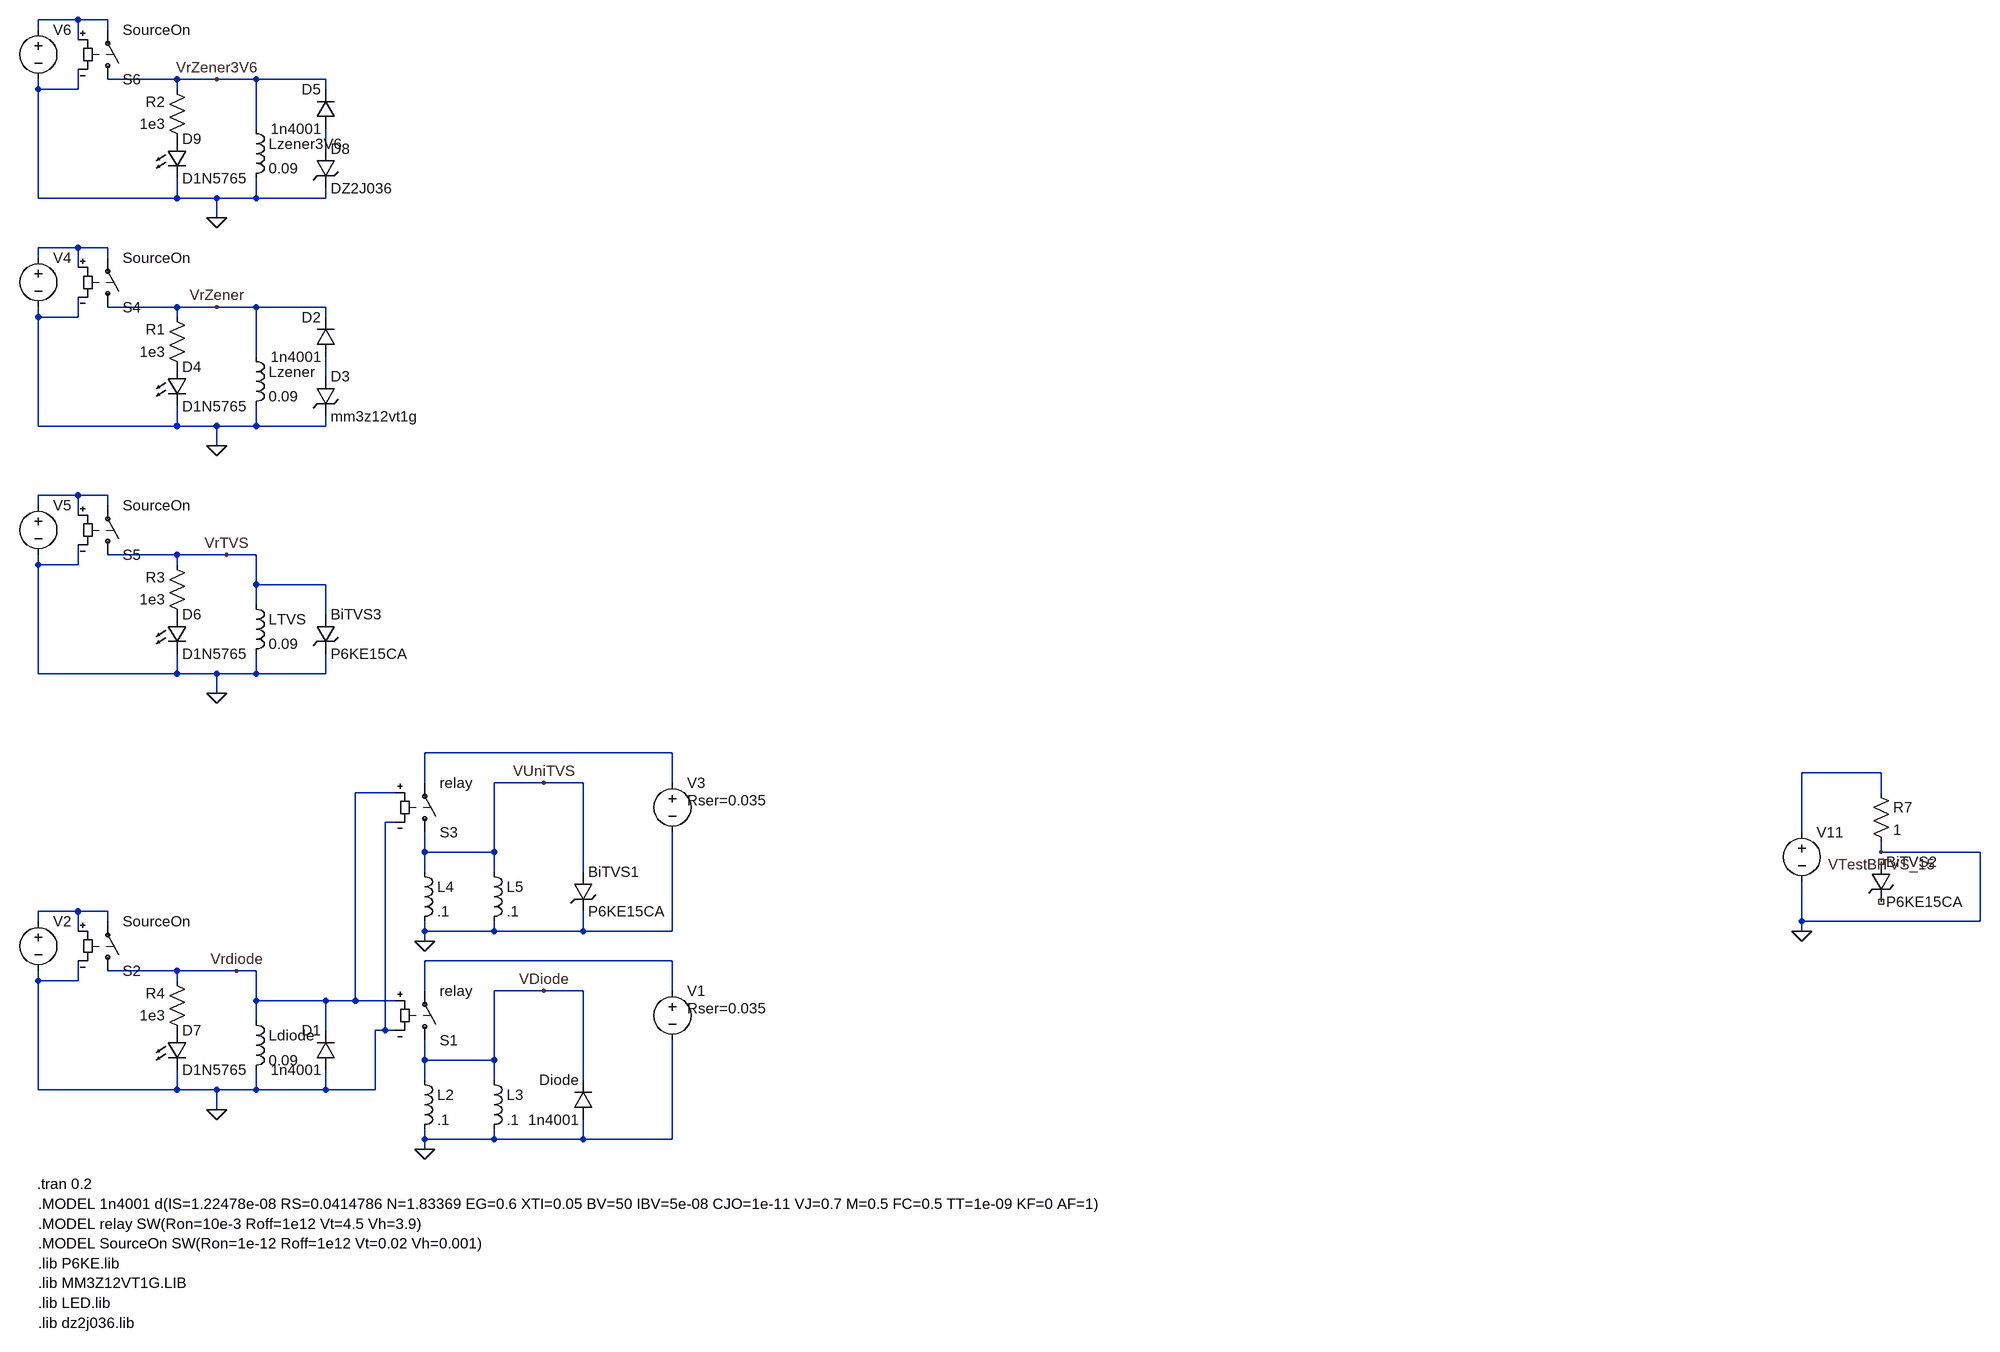
[diagram p0: schematic TVSTest.asc]
TVSTest.asc, the LTspice schematic file:
Version 4
SHEET 1 2628 680
WIRE -880 -1488 -944 -1488
WIRE -832 -1488 -880 -1488
WIRE -944 -1472 -944 -1488
WIRE -832 -1472 -832 -1488
WIRE -880 -1456 -880 -1488
WIRE -720 -1392 -832 -1392
WIRE -656 -1392 -720 -1392
WIRE -592 -1392 -656 -1392
WIRE -480 -1392 -592 -1392
WIRE -944 -1376 -944 -1392
WIRE -880 -1376 -880 -1408
WIRE -880 -1376 -944 -1376
WIRE -720 -1376 -720 -1392
WIRE -480 -1376 -480 -1392
WIRE -592 -1312 -592 -1392
WIRE -480 -1280 -480 -1312
WIRE -944 -1200 -944 -1376
WIRE -720 -1200 -720 -1232
WIRE -720 -1200 -944 -1200
WIRE -656 -1200 -720 -1200
WIRE -592 -1200 -592 -1232
WIRE -592 -1200 -656 -1200
WIRE -480 -1200 -480 -1216
WIRE -480 -1200 -592 -1200
WIRE -656 -1168 -656 -1200
WIRE -880 -1120 -944 -1120
WIRE -832 -1120 -880 -1120
WIRE -944 -1104 -944 -1120
WIRE -832 -1104 -832 -1120
WIRE -880 -1088 -880 -1120
WIRE -720 -1024 -832 -1024
WIRE -656 -1024 -720 -1024
WIRE -592 -1024 -656 -1024
WIRE -480 -1024 -592 -1024
WIRE -944 -1008 -944 -1024
WIRE -880 -1008 -880 -1040
WIRE -880 -1008 -944 -1008
WIRE -720 -1008 -720 -1024
WIRE -480 -1008 -480 -1024
WIRE -592 -944 -592 -1024
WIRE -480 -912 -480 -944
WIRE -944 -832 -944 -1008
WIRE -720 -832 -720 -864
WIRE -720 -832 -944 -832
WIRE -656 -832 -720 -832
WIRE -592 -832 -592 -864
WIRE -592 -832 -656 -832
WIRE -480 -832 -480 -848
WIRE -480 -832 -592 -832
WIRE -656 -800 -656 -832
WIRE -880 -720 -944 -720
WIRE -832 -720 -880 -720
WIRE -944 -704 -944 -720
WIRE -832 -704 -832 -720
WIRE -880 -688 -880 -720
WIRE -720 -624 -832 -624
WIRE -640 -624 -720 -624
WIRE -592 -624 -640 -624
WIRE -944 -608 -944 -624
WIRE -880 -608 -880 -640
WIRE -880 -608 -944 -608
WIRE -720 -608 -720 -624
WIRE -592 -576 -592 -624
WIRE -480 -576 -592 -576
WIRE -592 -544 -592 -576
WIRE -480 -528 -480 -576
WIRE -944 -432 -944 -608
WIRE -720 -432 -720 -464
WIRE -720 -432 -944 -432
WIRE -656 -432 -720 -432
WIRE -592 -432 -592 -464
WIRE -592 -432 -656 -432
WIRE -480 -432 -480 -464
WIRE -480 -432 -592 -432
WIRE -656 -400 -656 -432
WIRE 80 -304 -320 -304
WIRE 2032 -272 1904 -272
WIRE -320 -256 -320 -304
WIRE -128 -256 -208 -256
WIRE -64 -256 -128 -256
WIRE 80 -256 80 -304
WIRE -368 -240 -432 -240
WIRE 2032 -240 2032 -272
WIRE -368 -192 -384 -192
WIRE 1904 -176 1904 -272
WIRE -320 -144 -320 -176
WIRE -208 -144 -208 -256
WIRE -208 -144 -320 -144
WIRE 2032 -144 2032 -160
WIRE 2192 -144 2032 -144
WIRE -320 -112 -320 -144
WIRE -208 -112 -208 -144
WIRE -64 -112 -64 -256
WIRE -880 -48 -944 -48
WIRE -832 -48 -880 -48
WIRE -944 -32 -944 -48
WIRE -832 -32 -832 -48
WIRE 1904 -32 1904 -96
WIRE 2192 -32 2192 -144
WIRE 2192 -32 1904 -32
WIRE -880 -16 -880 -48
WIRE -320 -16 -320 -32
WIRE -208 -16 -208 -32
WIRE -208 -16 -320 -16
WIRE -64 -16 -64 -48
WIRE -64 -16 -208 -16
WIRE 80 -16 80 -176
WIRE 80 -16 -64 -16
WIRE 1904 -16 1904 -32
WIRE -320 0 -320 -16
WIRE 80 32 -320 32
WIRE -720 48 -832 48
WIRE -624 48 -720 48
WIRE -592 48 -624 48
WIRE -944 64 -944 48
WIRE -880 64 -880 32
WIRE -880 64 -944 64
WIRE -720 64 -720 48
WIRE -320 80 -320 32
WIRE -128 80 -208 80
WIRE -64 80 -128 80
WIRE 80 80 80 32
WIRE -592 96 -592 48
WIRE -480 96 -592 96
WIRE -432 96 -432 -240
WIRE -432 96 -480 96
WIRE -368 96 -432 96
WIRE -592 128 -592 96
WIRE -480 144 -480 96
WIRE -384 144 -384 -192
WIRE -384 144 -400 144
WIRE -368 144 -384 144
WIRE -320 192 -320 160
WIRE -208 192 -208 80
WIRE -208 192 -320 192
WIRE -320 224 -320 192
WIRE -208 224 -208 192
WIRE -64 224 -64 80
WIRE -944 240 -944 64
WIRE -720 240 -720 208
WIRE -720 240 -944 240
WIRE -656 240 -720 240
WIRE -592 240 -592 208
WIRE -592 240 -656 240
WIRE -480 240 -480 208
WIRE -480 240 -592 240
WIRE -400 240 -400 144
WIRE -400 240 -480 240
WIRE -656 272 -656 240
WIRE -320 320 -320 304
WIRE -208 320 -208 304
WIRE -208 320 -320 320
WIRE -64 320 -64 288
WIRE -64 320 -208 320
WIRE 80 320 80 160
WIRE 80 320 -64 320
WIRE -320 336 -320 320
FLAG -320 336 0
FLAG -656 272 0
FLAG -320 0 0
FLAG -128 80 VDiode
FLAG -128 -256 VUniTVS
FLAG 1904 -16 0
FLAG 2032 -144 VTestBiTVS_15
FLAG -656 -400 0
FLAG -656 -800 0
FLAG -624 48 Vrdiode
FLAG -640 -624 VrTVS
FLAG -656 -1024 VrZener
FLAG -656 -1168 0
FLAG -656 -1392 VrZener3V6
SYMBOL ind -608 112 R0
SYMATTR InstName Ldiode
SYMATTR Value 0.09
SYMATTR SpiceLine Rser=320
SYMBOL diode -464 208 R180
WINDOW 0 24 64 Left 2
WINDOW 3 24 0 Left 2
SYMATTR InstName D1
SYMATTR Value 1n4001
SYMBOL sw -320 176 M180
SYMATTR InstName S1
SYMATTR Value relay
SYMBOL ind -336 208 R0
SYMATTR InstName L2
SYMATTR Value .1
SYMATTR SpiceLine Rser=12
SYMBOL ind -224 208 R0
SYMATTR InstName L3
SYMATTR Value .1
SYMATTR SpiceLine Rser=12
SYMBOL diode -48 288 R180
WINDOW 0 24 64 Left 2
WINDOW 3 24 0 Left 2
SYMATTR InstName Diode
SYMATTR Value 1n4001
SYMBOL voltage -944 -48 R0
WINDOW 3 24 96 Invisible 2
WINDOW 123 0 0 Left 2
WINDOW 39 0 0 Left 2
SYMATTR InstName V2
SYMATTR Value PWL(0 0 0.000001 12.6 0.1 12.6 0.100001 0)
SYMBOL voltage 80 64 R0
WINDOW 3 24 96 Invisible 2
WINDOW 123 0 0 Left 2
WINDOW 39 24 44 Left 2
SYMATTR InstName V1
SYMATTR Value 12.6
SYMATTR SpiceLine Rser=0.035
SYMBOL sw -832 64 M180
SYMATTR InstName S2
SYMATTR Value SourceOn
SYMBOL sw -320 -160 M180
SYMATTR InstName S3
SYMATTR Value relay
SYMBOL ind -336 -128 R0
SYMATTR InstName L4
SYMATTR Value .1
SYMATTR SpiceLine Rser=12
SYMBOL ind -224 -128 R0
SYMATTR InstName L5
SYMATTR Value .1
SYMATTR SpiceLine Rser=12
SYMBOL voltage 80 -272 R0
WINDOW 3 24 96 Invisible 2
WINDOW 123 0 0 Left 2
WINDOW 39 24 44 Left 2
SYMATTR InstName V3
SYMATTR Value 12.6
SYMATTR SpiceLine Rser=0.035
SYMBOL voltage 1904 -192 R0
WINDOW 3 24 96 Invisible 2
WINDOW 123 0 0 Left 2
WINDOW 39 0 0 Left 2
SYMATTR InstName V11
SYMATTR Value PWL(0 0 0.2 120)
SYMBOL TVSdiode 2016 -128 R0
SYMATTR InstName BiTVS2
SYMATTR Value P6KE15CA
SYMATTR Prefix x
SYMBOL res 2016 -256 R0
SYMATTR InstName R7
SYMATTR Value 1
SYMBOL TVSdiode -80 -112 R0
SYMATTR InstName BiTVS1
SYMATTR Value P6KE15CA
SYMATTR Prefix x
SYMBOL ind -608 -560 R0
SYMATTR InstName LTVS
SYMATTR Value 0.09
SYMATTR SpiceLine Rser=320
SYMBOL voltage -944 -720 R0
WINDOW 3 24 96 Invisible 2
WINDOW 123 0 0 Left 2
WINDOW 39 0 0 Left 2
SYMATTR InstName V5
SYMATTR Value PWL(0 0 0.000001 12.6 0.1 12.6 0.100001 0)
SYMBOL sw -832 -608 M180
SYMATTR InstName S5
SYMATTR Value SourceOn
SYMBOL TVSdiode -496 -528 R0
SYMATTR InstName BiTVS3
SYMATTR Value P6KE15CA
SYMATTR Prefix x
SYMBOL ind -608 -960 R0
SYMATTR InstName Lzener
SYMATTR Value 0.09
SYMATTR SpiceLine Rser=320
SYMBOL voltage -944 -1120 R0
WINDOW 3 24 96 Invisible 2
WINDOW 123 0 0 Left 2
WINDOW 39 0 0 Left 2
SYMATTR InstName V4
SYMATTR Value PWL(0 0 0.000001 12.6 0.1 12.6 0.100001 0)
SYMBOL sw -832 -1008 M180
SYMATTR InstName S4
SYMATTR Value SourceOn
SYMBOL diode -464 -944 R180
WINDOW 0 24 64 Left 2
WINDOW 3 24 0 Left 2
SYMATTR InstName D2
SYMATTR Value 1n4001
SYMBOL zener -496 -912 R0
SYMATTR InstName D3
SYMATTR Value mm3z12vt1g
SYMATTR Prefix X
SYMBOL LED -736 -928 R0
SYMATTR InstName D4
SYMATTR Value D1N5765
SYMATTR Prefix X
SYMBOL res -704 -912 R180
WINDOW 0 36 76 Left 2
WINDOW 3 36 40 Left 2
SYMATTR InstName R1
SYMATTR Value 1e3
SYMBOL LED -736 -528 R0
SYMATTR InstName D6
SYMATTR Value D1N5765
SYMATTR Prefix X
SYMBOL res -704 -512 R180
WINDOW 0 36 76 Left 2
WINDOW 3 36 40 Left 2
SYMATTR InstName R3
SYMATTR Value 1e3
SYMBOL LED -736 144 R0
SYMATTR InstName D7
SYMATTR Value D1N5765
SYMATTR Prefix X
SYMBOL res -704 160 R180
WINDOW 0 36 76 Left 2
WINDOW 3 36 40 Left 2
SYMATTR InstName R4
SYMATTR Value 1e3
SYMBOL ind -608 -1328 R0
SYMATTR InstName Lzener3V6
SYMATTR Value 0.09
SYMATTR SpiceLine Rser=320
SYMBOL voltage -944 -1488 R0
WINDOW 3 24 96 Invisible 2
WINDOW 123 0 0 Left 2
WINDOW 39 0 0 Left 2
SYMATTR InstName V6
SYMATTR Value PWL(0 0 0.000001 12.6 0.1 12.6 0.100001 0)
SYMBOL sw -832 -1376 M180
SYMATTR InstName S6
SYMATTR Value SourceOn
SYMBOL diode -464 -1312 R180
WINDOW 0 24 64 Left 2
WINDOW 3 24 0 Left 2
SYMATTR InstName D5
SYMATTR Value 1n4001
SYMBOL zener -496 -1280 R0
SYMATTR InstName D8
SYMATTR Value DZ2J036
SYMATTR Prefix X
SYMBOL LED -736 -1296 R0
SYMATTR InstName D9
SYMATTR Value D1N5765
SYMATTR Prefix X
SYMBOL res -704 -1280 R180
WINDOW 0 36 76 Left 2
WINDOW 3 36 40 Left 2
SYMATTR InstName R2
SYMATTR Value 1e3
TEXT -946 392 Left 2 !.tran 0.2
TEXT -944 424 Left 2 !.MODEL 1n4001 d(IS=1.22478e-08 RS=0.0414786 N=1.83369 EG=0.6 XTI=0.05 BV=50 IBV=5e-08 CJO=1e-11 VJ=0.7 M=0.5 FC=0.5 TT=1e-09 KF=0 AF=1)
TEXT -944 456 Left 2 !.MODEL relay SW(Ron=10e-3 Roff=1e12 Vt=4.5 Vh=3.9)
TEXT -944 488 Left 2 !.MODEL SourceOn SW(Ron=1e-12 Roff=1e12 Vt=0.02 Vh=0.001)
TEXT -944 520 Left 2 !.lib P6KE.lib
TEXT -944 552 Left 2 !.lib MM3Z12VT1G.LIB
TEXT -944 584 Left 2 !.lib LED.lib
TEXT -944 616 Left 2 !.lib dz2j036.lib

The netlist it stands for:
* TVSTest.asc
Ldiode Vrdiode 0 0.09 Rser=320
D1 0 Vrdiode 1n4001
S1 VDiode N009 Vrdiode 0 relay
L2 VDiode 0 .1 Rser=12
L3 VDiode 0 .1 Rser=12
Diode 0 VDiode 1n4001
V2 N008 0 PWL(0 0 0.000001 12.6 0.1 12.6 0.100001 0)
V1 N009 0 12.6 Rser=0.035
S2 Vrdiode N008 N008 0 SourceOn
S3 VUniTVS N006 Vrdiode 0 relay
L4 VUniTVS 0 .1 Rser=12
L5 VUniTVS 0 .1 Rser=12
V3 N006 0 12.6 Rser=0.035
V11 N007 0 PWL(0 0 0.2 120)
XBiTVS2 NC_01 NC_02 P6KE15CA  ; pins + -
R7 N007 0 1
XBiTVS1 VUniTVS 0 P6KE15CA  ; pins + -
LTVS VrTVS 0 0.09 Rser=320
V5 N005 0 PWL(0 0 0.000001 12.6 0.1 12.6 0.100001 0)
S5 VrTVS N005 N005 0 SourceOn
XBiTVS3 VrTVS 0 P6KE15CA  ; pins + -
Lzener VrZener 0 0.09 Rser=320
V4 N003 0 PWL(0 0 0.000001 12.6 0.1 12.6 0.100001 0)
S4 VrZener N003 N003 0 SourceOn
D2 N004 VrZener 1n4001
XD3 N004 0 mm3z12vt1g  ; pins + -
XD4 P001 0 D1N5765  ; pins + -
R1 P001 VrZener 1e3
XD6 P002 0 D1N5765  ; pins + -
R3 P002 VrTVS 1e3
XD7 P003 0 D1N5765  ; pins + -
R4 P003 Vrdiode 1e3
Lzener3V6 VrZener3V6 0 0.09 Rser=320
V6 N001 0 PWL(0 0 0.000001 12.6 0.1 12.6 0.100001 0)
S6 VrZener3V6 N001 N001 0 SourceOn
D5 N002 VrZener3V6 1n4001
XD8 N002 0 DZ2J036  ; pins + -
XD9 P004 0 D1N5765  ; pins + -
R2 P004 VrZener3V6 1e3
.model D D
.lib standard.dio
.tran 0.2
.MODEL 1n4001 d(IS=1.22478e-08 RS=0.0414786 N=1.83369 EG=0.6 XTI=0.05 BV=50 IBV=5e-08 CJO=1e-11 VJ=0.7 M=0.5 FC=0.5 TT=1e-09 KF=0 AF=1)
.MODEL relay SW(Ron=10e-3 Roff=1e12 Vt=4.5 Vh=3.9)
.MODEL SourceOn SW(Ron=1e-12 Roff=1e12 Vt=0.02 Vh=0.001)
.lib P6KE.lib
.lib MM3Z12VT1G.LIB
.lib LED.lib
.lib dz2j036.lib
.backanno
.end